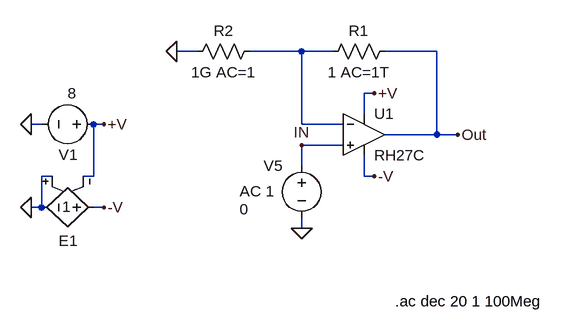
[diagram p0: schematic RH27C_AC_Sim_OpenLoop.asc]
RH27C_AC_Sim_OpenLoop.asc, the LTspice schematic file:
Version 4
SHEET 1 2812 688
WIRE 1440 64 1408 64
WIRE 1600 64 1520 64
WIRE 1648 64 1600 64
WIRE 1808 64 1728 64
WIRE 1712 128 1696 128
WIRE 1696 160 1696 128
WIRE 1200 176 1184 176
WIRE 1296 176 1280 176
WIRE 1600 176 1600 64
WIRE 1664 176 1600 176
WIRE 1808 192 1808 64
WIRE 1808 192 1728 192
WIRE 1840 192 1808 192
WIRE 1664 208 1600 208
WIRE 1600 240 1600 208
WIRE 1216 256 1200 256
WIRE 1280 256 1280 176
WIRE 1280 256 1264 256
WIRE 1696 256 1696 224
WIRE 1712 256 1696 256
WIRE 1200 304 1200 256
WIRE 1200 304 1184 304
WIRE 1296 304 1280 304
WIRE 1600 336 1600 320
FLAG 1184 176 0
FLAG 1184 304 0
FLAG 1600 336 0
FLAG 1712 128 +V
FLAG 1712 256 -V
FLAG 1840 192 Out
FLAG 1296 176 +V
FLAG 1296 304 -V
FLAG 1600 208 IN
FLAG 1408 64 0
SYMBOL voltage 1296 176 R90
WINDOW 123 0 0 Left 2
WINDOW 39 0 0 Left 2
WINDOW 0 47 40 VRight 2
WINDOW 3 -48 42 VRight 2
SYMATTR InstName V1
SYMATTR Value 8
SYMBOL voltage 1600 224 R0
WINDOW 0 -58 16 Left 2
WINDOW 3 -95 83 Left 2
WINDOW 123 -95 55 Left 2
WINDOW 39 0 0 Left 2
SYMATTR InstName V5
SYMATTR Value 0
SYMATTR Value2 AC 1
SYMBOL e2 1296 304 R90
WINDOW 0 51 40 VRight 2
WINDOW 3 -1 51 VRight 2
SYMATTR InstName E1
SYMATTR Value 1
SYMBOL Opamps\\RH27C 1696 128 R0
SYMATTR InstName U1
SYMBOL res 1744 48 R90
WINDOW 0 0 56 VBottom 2
WINDOW 3 32 56 VTop 2
SYMATTR InstName R1
SYMATTR Value 1 AC=1T
SYMBOL res 1536 48 R90
WINDOW 0 0 56 VBottom 2
WINDOW 3 32 56 VTop 2
SYMATTR InstName R2
SYMATTR Value 1G AC=1
TEXT 1744 448 Left 2 !.ac dec 20 1 100Meg

The netlist it stands for:
* RH27C_AC_Sim_OpenLoop.asc
V1 +V 0 8
V5 IN 0 0 AC 1
E1 -V 0 0 +V 1
XU1 IN N001 +V -V Out RH27C  ; pins In+ In- V+ V- OUT
R1 Out N001 1 AC=1T
R2 N001 0 1G AC=1
.ac dec 20 1 100Meg
.backanno
.end